# EAGLE design Main Board (EAGLE 5.11)
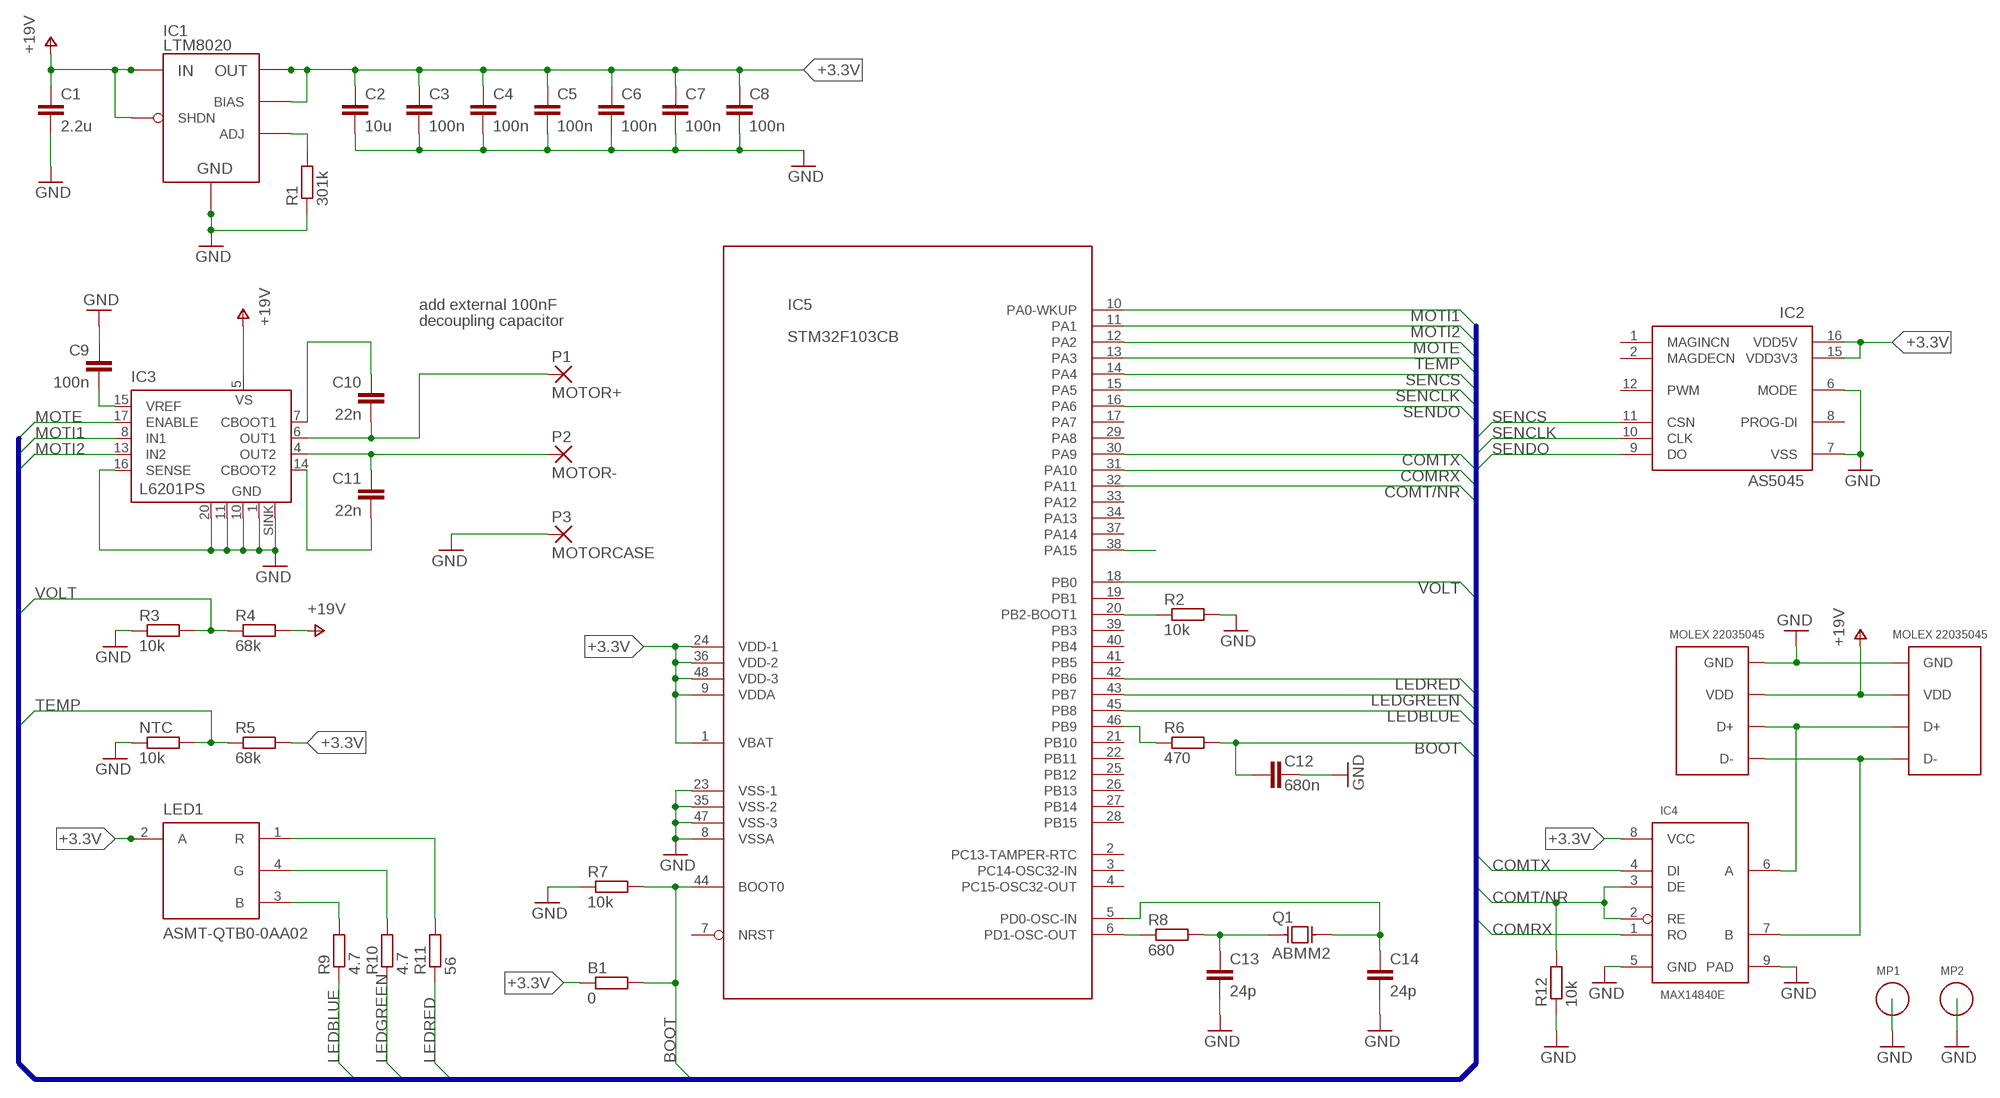
[diagram p0: schematic, sheet 1]

## Parts
B1  0  R-EU_R0603  [R0603]
C1  2.2u  C-EUC1206  [C1206]
C2  10u  C-EUC1206  [C1206]
C3  100n  C-EUC0402  [C0402]
C4  100n  C-EUC0402  [C0402]
C5  100n  C-EUC0402  [C0402]
C6  100n  C-EUC0402  [C0402]
C7  100n  C-EUC0402  [C0402]
C8  100n  C-EUC0402  [C0402]
C9  100n  C-EUC0402  [C0402]
C10  22n  C-EUC0402  [C0402]
C11  22n  C-EUC0402  [C0402]
C12  680n  C-EUC0603  [C0603]
C13  24p  C-EUC0402  [C0402]
C14  24p  C-EUC0402  [C0402]
IC1  LTM8020  [LGA21]
IC2  AS5045  [SSOP16]
IC3  L6201PS  [POWERSO20]
IC4  MAX14840E  [TDFN8]
IC5  STM32F103CB  [LQFP48]
LED1  ASMT-QTB0-0AA02  [PLCC4]
MP1  MOUNTINGPAD-64  [PAD-2X3-ROUND]
MP2  MOUNTINGPAD-64  [PAD-2X3-ROUND]
NTC  10k  R-EU_R0603  [R0603]
P1  MOTOR+  PAD-2X3  [PAD-2X3]
P2  MOTOR-  PAD-2X3  [PAD-2X3]
P3  MOTORCASE  PAD-2X3  [PAD-2X3]
Q1  ABMM2  [CRYSTAL-6X3.6]
R1  301k  R-EU_R0603  [R0603]
R2  10k  R-EU_R0402  [R0402]
R3  10k  R-EU_R0402  [R0402]
R4  68k  R-EU_R0402  [R0402]
R5  68k  R-EU_R0402  [R0402]
R6  470  R-EU_R0402  [R0402]
R7  10k  R-EU_R0402  [R0402]
R8  680  R-EU_R0402  [R0402]
R9  4.7  R-EU_R0402  [R0402]
R10  4.7  R-EU_R0402  [R0402]
R11  56  R-EU_R0402  [R0402]
R12  10k  R-EU_R0402  [R0402]
U1  MOLEX22035045  [MOLEX22035045]
U2  MOLEX22035045  [MOLEX22035045]

## Nets
+3.3V [lowpower]: B1.1 C2.1 C3.1 C4.1 C5.1 C6.1 C7.1 C8.1 IC1.A4(OUT) IC1.A5(OUT) IC1.B4(OUT) IC1.B5(OUT) IC1.C3(BIAS) IC1.C4(OUT) IC1.C5(OUT) IC2.15(VDD3V3) IC2.16(VDD5V) IC4.8(VCC) IC5.1(VBAT) IC5.9(VDDA) IC5.24(VDD-1) IC5.36(VDD-2) IC5.48(VDD-3) LED1.2(A) LED1.SINK1(A) LED1.SINK2(A) R5.2
BOOT: B1.2 C12.2 IC5.44(BOOT0) R6.2 R7.2
COMRX: IC4.1(RO) IC5.31(PA10)
COMT/NR: IC4.2(RE) IC4.3(DE) IC5.32(PA11) R12.2
COMTX: IC4.4(DI) IC5.30(PA9)
GND [gnd]: C1.2 C2.2 C3.2 C4.2 C5.2 C6.2 C7.2 C8.2 C9.1 C12.1 C13.2 C14.2 IC1.C2(GND) IC1.D1(GND) IC1.D2(GND) IC1.D3(GND) IC1.D4(GND) IC1.D5(GND) IC1.E2(GND) IC1.E3(GND) IC1.E4(GND) IC1.E5(GND) IC2.6(MODE) IC2.7(VSS) IC3.1(GND) IC3.10(GND) IC3.11(GND) IC3.16(SENSE) IC3.20(GND) IC3.SINK IC4.5(GND) IC4.9(PAD) IC5.8(VSSA) IC5.23(VSS-1) IC5.35(VSS-2) IC5.47(VSS-3) MP1.1(MP) MP2.1(MP) NTC.1 P3.1 R1.1 R2.2 R3.1 R7.1 R12.1 U1.GND U2.GND
LEDBLUE: IC5.45(PB8) R9.1
LEDGREEN: IC5.43(PB7) R10.1
LEDRED: IC5.42(PB6) R11.1
MOTE: IC3.17(ENABLE) IC5.12(PA2)
MOTI1: IC3.8(IN1) IC5.10(PA0-WKUP)
MOTI2: IC3.13(IN2) IC5.11(PA1)
N$1: IC5.20(PB2-BOOT1) R2.1
N$2: IC5.46(PB9) R6.1
N$3: LED1.3(B) R9.2
N$4 [lowpower]: IC1.E1(ADJ) R1.2
N$5: LED1.4(G) R10.2
N$6: LED1.1(R) R11.2
N$7: C14.1 IC5.5(PD0-OSC-IN) Q1.3
N$8: C13.1 Q1.1 R8.2
N$9: IC5.6(PD1-OSC-OUT) R8.1
N$10: C9.2 IC3.15(VREF)
N$11: IC5.38(PA15)
N$12 [motor]: C10.2 IC3.6(OUT1) P1.1
N$13: IC4.7(B) U1.D- U2.D-
N$14: IC4.6(A) U1.D+ U2.D+
N$15 [lowpower]: C10.1 IC3.7(CBOOT1)
N$16 [lowpower]: C11.2 IC3.14(CBOOT2)
N$18 [motor]: C11.1 IC3.4(OUT2) P2.1
SENCLK: IC2.10(CLK) IC5.15(PA5)
SENCS: IC2.11(CSN) IC5.14(PA4)
SENDO: IC2.9(DO) IC5.16(PA6)
TEMP: IC5.13(PA3) NTC.2 R5.1
V+ [highpower]: C1.1 IC1.A1(IN) IC1.A2(IN) IC1.C1(SHDN) IC3.5(VS) R4.2 U1.VDD U2.VDD ; supply symbol labelled +19V
VOLT: IC5.18(PB0) R3.2 R4.1
Unconnected: IC2.1(MAGINCN) IC2.2(MAGDECN) IC2.8(PROG-DI) IC2.12(PWM) IC5.2(PC13-TAMPER-RTC) IC5.3(PC14-OSC32-IN) IC5.4(PC15-OSC32-OUT) IC5.7(NRST) IC5.17(PA7) IC5.19(PB1) IC5.21(PB10) IC5.22(PB11) IC5.25(PB12) IC5.26(PB13) IC5.27(PB14) IC5.28(PB15) IC5.29(PA8) IC5.33(PA12) IC5.34(PA13) IC5.37(PA14) IC5.39(PB3) IC5.40(PB4) IC5.41(PB5)

## Buses
COMT/NR,COMTX,COMRX,MOTE,MOTI1,MOTI2,SENCS,SENCLK,SENDO,LEDRED,LEDGREEN,LEDBLUE,BOOT,TEMP,VOLT

## Notes on the sheet
- add external 100nF
- decoupling capacitor
- LEDRED
- LEDGREEN
- LEDBLUE

## Library data of the parts
B1 NTC R1-R12 = rcl:R-EU_: RESISTOR, European symbol
C1-C14 = rcl:C-EU: CAPACITOR, European symbol
IC1 = sim:LTM8020: VOLTAGE REGULATOR LTM8020
IC2 = sim:AS5045: ANGULAR ENCODER AS5045
IC3 = sim:L6201: DMOS FULL BRIDGE DRIVER
IC4 = sim:MAX14840E: TRANSCEIVER MAX14840E
IC5 = sim:STM32F103CB: CONTROLLER STM32F103CB
LED1 = sim:ASMT-QTB0-0AA02: LED RGB ASMT-QTB0-0AA02
MP1 MP2 = sim:MOUNTINGPAD-64: MOUNTING PAD FOR DD-64
P1-P3 = sim:PAD-2X3: SMD PAD 2mm x 3mm
Q1 = sim:ABMM2: CERAMIC CRYSTAL ABMM2
U1 U2 = sim:MOLEX22035045: CONNECTOR MOLEX22035045

## Net classes
0 default: width 0.15 mm, drill 0.3 mm, clearance 0.15 mm
1 motor: width 0.15 mm, drill 0.3 mm, clearance 0.15 mm
2 highpower: width 0.15 mm, drill 0.3 mm, clearance 0.15 mm
3 lowpower: width 0.15 mm, drill 0.3 mm, clearance 0.15 mm
4 gnd: width 0.15 mm, drill 0.3 mm, clearance 0.15 mm

## Board
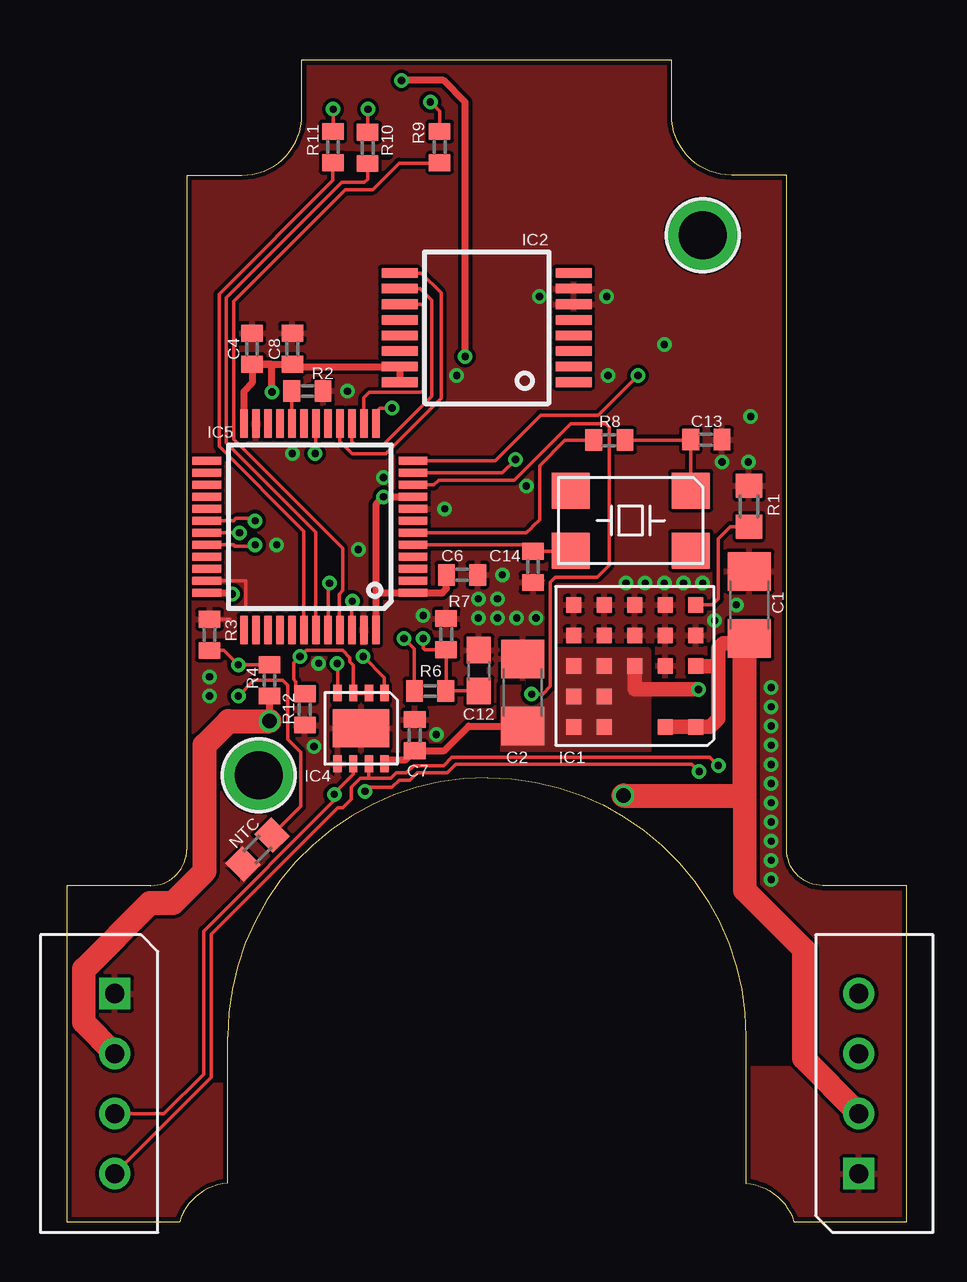
[diagram p1: board, top side]
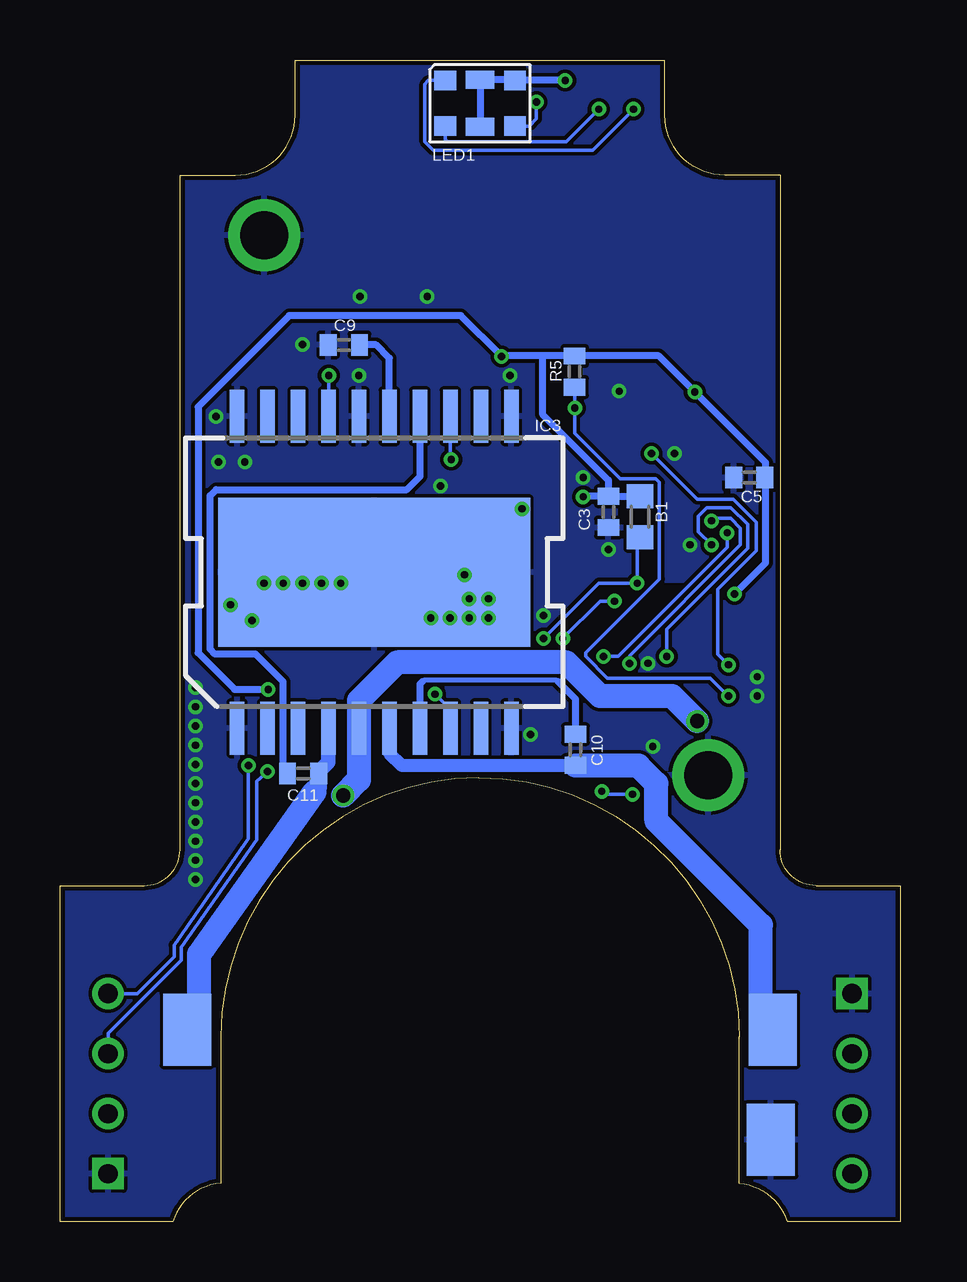
[diagram p2: board, bottom side, seen from below]

Size 35 x 48.4 mm. Coordinates in mm from the lower left corner, seen from the top.
Outline: 0,0 4.7,0 arc-67 6.7,1.6 6.7,7.7 arc-90 17.55,18.5 arc-90 28.3,7.7 28.3,1.6 arc-67 30.3,0 35,0 35,14 31.5,14 arc-90 30,15.5 30,43.6 27.7,43.6 arc-90 25.2,46.1 25.2,48.4 9.8,48.4 9.8,46.1 arc-90 7.3,43.6 5,43.6 5,15.5 arc-90 3.5,14 0,14 0,0
Copper layers (1*16): Top 0.035mm / dielectric 1.5mm / Bottom 0.035mm
Design rules "default *": minimum track width 0.15mm, minimum drill 0.3mm, track to track 0.15mm, track to pad 0.15mm, pad to pad 0.15mm, via to via 0.15mm, smd to smd 0.15mm, copper to edge 0.2mm, drill to drill 0.15mm, minimum pad ring 10mil, minimum via ring 6mil, stop-mask expansion 4mil, vias tented up to drill 0mil, thermal gap 0.15mm
tKeepout: area 10,41.3 to 14,42.8; area 10,35 to 14,36.5; area 21,41.3 to 25,42.8; area 21,35 to 25,36.5; area 14.8,29.9 to 16.3,33.4; area 18.7,29.9 to 20.2,33.4; area 20.2,43.4 to 21.7,46.4; area 13.3,43.4 to 14.8,46.4; area 5,18.1 to 6.3,19.1; area 27.8,21.8 to 30,23.3; area 5,21.8 to 7.2,23.3; area 27.8,36.8 to 30,38.3; 1 more areas
bKeepout: area 14,33.9 to 21,40.9; area 16.5,40.9 to 18.5,44.7; area 29,18.5 to 30,20; area 5,18.5 to 6,20; area 29,34 to 30,35.5; area 5,34 to 6,35.5
tRestrict: area 13.1,44.4 to 13.4,44.5; area 11.6,44.4 to 12,44.5; area 6.2,6 to 6.5,6.2; area 28.4,6.7 to 30.1,6.8; area 16.9,22.8 to 17.4,23.1; area 14.9,21.6 to 15.4,21.8; area 13.7,29.6 to 13.8,29.9; area 6.5,24.1 to 7.1,24.1; area 7.8,33.9 to 8,34.1; area 10.1,34.4 to 10.2,34.8
bRestrict: area 9,26.6 to 9.9,26.6; area 6.1,31.5 to 6.5,31.5; area 6.3,30.8 to 6.5,31.2; area 11.6,29.4 to 11.8,29.8; area 13.2,35.2 to 13.4,35.6; area 24.2,21.7 to 24.6,21.8; area 23.1,21.7 to 23.5,21.8

### Footprints (pad centres in the part's own frame; a part is rotated, then mirrored left to right if it is on the bottom)
R0603 = smd 1 x 1.1: 1 -0.85,0; 2 0.85,0
C1206 = smd 1.6 x 1.8: 1 -1.4,0; 2 1.4,0
C0402 = smd 0.7 x 0.9: 1 -0.65,0; 2 0.65,0
C0603 = smd 1.1 x 1: 1 -0.85,0; 2 0.85,0
LGA21 = smd 0.635 x 0.635: A1 2.54,-2.54; A2 1.27,-2.54; A4 -1.27,-2.54; A5 -2.54,-2.54; B4 -1.27,-1.27; B5 -2.54,-1.27; C1 2.54,0; C2 1.27,0; C3 0,0; C4 -1.27,0; C5 -2.54,0; D1 2.54,1.27; D2 1.27,1.27; D3 0,1.27; D4 -1.27,1.27; D5 -2.54,1.27; E1 2.54,2.54; E2 1.27,2.54; E3 0,2.54; E4 -1.27,2.54; E5 -2.54,2.54
SSOP16 = smd 1.5 x 0.4: 1 3.625,-2.275; 2 3.625,-1.625; 3 3.625,-0.975; 4 3.625,-0.325; 5 3.625,0.325; 6 3.625,0.975; 7 3.625,1.625; 8 3.625,2.275; 9 -3.625,2.275; 10 -3.625,1.625; 11 -3.625,0.975; 12 -3.625,0.325; 13 -3.625,-0.325; 14 -3.625,-0.975; 15 -3.625,-1.625; 16 -3.625,-2.275
POWERSO20 = smd 0.6 x 2.2: 1 -5.715,-6.5; 2 -4.445,-6.5; 3 -3.175,-6.5; 4 -1.905,-6.5; 5 -0.635,-6.5; 6 0.635,-6.5; 7 1.905,-6.5; 8 3.175,-6.5; 9 4.445,-6.5; 10 5.715,-6.5; 11 5.715,6.5; 12 4.445,6.5; 13 3.175,6.5; 14 1.905,6.5; 15 0.635,6.5; 16 -0.635,6.5; 17 -1.905,6.5; 18 -3.175,6.5; 19 -4.445,6.5; 20 -5.715,6.5 | smd 13 x 6.2: SINK 0,0
TDFN8 = smd 0.35 x 0.7: 1 -0.975,-1.475; 2 -0.325,-1.475; 3 0.325,-1.475; 4 0.975,-1.475; 5 0.975,1.475; 6 0.325,1.475; 7 -0.325,1.475; 8 -0.975,1.475 | smd 2.35 x 1.58: 9 0,0
LQFP48 = smd 1.2 x 0.32: 1 -4.3,2.75; 2 -4.3,2.25; 3 -4.3,1.75; 4 -4.3,1.25; 5 -4.3,0.75; 6 -4.3,0.25; 7 -4.3,-0.25; 8 -4.3,-0.75; 9 -4.3,-1.25; 10 -4.3,-1.75; 11 -4.3,-2.25; 12 -4.3,-2.75; 25 4.3,-2.75; 26 4.3,-2.25; 27 4.3,-1.75; 28 4.3,-1.25; 29 4.3,-0.75; 30 4.3,-0.25; 31 4.3,0.25; 32 4.3,0.75; 33 4.3,1.25; 34 4.3,1.75; 35 4.3,2.25; 36 4.3,2.75 | smd 0.32 x 1.2: 13 -2.75,-4.3; 14 -2.25,-4.3; 15 -1.75,-4.3; 16 -1.25,-4.3; 17 -0.75,-4.3; 18 -0.25,-4.3; 19 0.25,-4.3; 20 0.75,-4.3; 21 1.25,-4.3; 22 1.75,-4.3; 23 2.25,-4.3; 24 2.75,-4.3; 37 2.75,4.3; 38 2.25,4.3; 39 1.75,4.3; 40 1.25,4.3; 41 0.75,4.3; 42 0.25,4.3; 43 -0.25,4.3; 44 -0.75,4.3; 45 -1.25,4.3; 46 -1.75,4.3; 47 -2.25,4.3; 48 -2.75,4.3
PLCC4 = smd 0.8 x 0.9: 1 -0.95,-1.45; 2 -0.95,1.45; 3 0.95,1.45; 4 0.95,-1.45 | smd 0.75 x 1.2: SINK1 -0.975,0; SINK2 0.975,0
PAD-2X3-ROUND = drill 2 pad 3 round: 1 0,0
PAD-2X3 = smd 3 x 2: 1 0,0
CRYSTAL-6X3.6 = smd 1.6 x 1.5: 1 -2.5,-1.25; 2 2.5,-1.25; 3 2.5,1.25; 4 -2.5,1.25
R0402 = smd 0.7 x 0.9: 1 -0.65,0; 2 0.65,0
MOLEX22035045 = drill 0.8 round: D+ 7.45,3.1; D- 9.95,3.1; VDD 4.95,3.1 | drill 0.8 square: GND 2.45,3.1

### Placement (x,y rotation side)
B1  10.84,29.36 270 bottom
C1  28.44,25.69 90 top
C2  19,22.04 90 top
C3  12.15,29.57 270 bottom
C4  7.72,36.37 90 top
C5  6.28,31 180 bottom
C6  16.47,26.95 0 top
C7  14.5,20.27 90 top
C8  9.4,36.37 90 top
C9  23.17,36.53 0 bottom
C10  13.52,19.66 270 bottom
C11  24.87,18.67 180 bottom
C12  17.17,22.96 270 top
C13  26.65,32.58 0 top
C14  19.43,27.28 270 top
IC1  23.67,23.15 0 top
IC2  17.5,37.25 0 top
IC3  21.91,27.05 0 bottom
IC4  12.26,20.55 180 top
IC5  10.13,28.95 180 top
LED1  17.5,46.6 270 bottom
MP1  8,18.6 0 top
MP2  26.5,41.1 0 top
NTC  7.95,15.5 45 top
P1  5.3,8 90 bottom
P2  29.7,8 90 bottom
P3  5.38,3.4 90 bottom
Q1  23.5,29.21 180 top
R1  28.43,29.8 270 top
R2  10.03,34.61 0 top
R3  5.95,24.45 270 top
R4  8.45,22.55 270 top
R5  13.56,35.42 90 bottom
R6  15.14,22.11 0 top
R7  15.81,24.48 270 top
R8  22.61,32.56 0 top
R9  15.54,44.77 90 top
R10  12.54,44.74 90 top
R11  11.09,44.77 90 top
R12  9.92,21.34 90 top
U1  36.1,-0.45 90 top
U2  -1.1,11.95 270 top

### Tracks (layer width: path | path; a pad name or v marks a point on that pad's centre or on a via)
+3.3V  (via drill 0.3)
  Top 0.3: IC1.B5 21.31,21.9 | IC5.24 7.38,34.58 7.72,34.95 C4.1 | C4.1 C8.1 9.49,35.62 IC2.15 IC2.16 | v8.55,34.57 8.55,35.72 C4.1 | IC5.9 | IC5.1 | IC5.36 6.65,26.2 v6.9,26.15 | IC5.9 | 12.88,26.15 IC5.48 | 12.88,26.15 12.88,29.88 v13.2,30.2 IC5.9 | IC5.1 12.93,26.2 12.88,26.15 | IC5.1 15.65,26.2 15.82,26.37 C6.1 | v13.95,47.55 15.7,47.55 16.6,46.65 v16.6,36.05 | IC4.8 13.24,19.25 14.13,19.25 C7.1 15.72,19.62 16.75,20.65 C2.1
  Top 0.6: v26.32,22.18 23.67,22.18 IC1.C3
  Bottom 0.3: LED1.SINK1 LED1.SINK2 | LED1.SINK1 17.48,47.55 | LED1.SINK1 16.07,47.58 LED1.2 v13.95,47.55 | 5.6,31.03 5.6,31.62 v8.55,34.57 10.05,36.07 R5.2 14.9,36.07 | 5.6,31.03 C5.1 | C3.1 12.15,30.9 14.9,33.65 14.9,36.07 | C3.1 13.18,30.22 v13.2,30.2 | 14.9,36.07 16.6,36.07 v16.6,36.05 18.3,37.75 25.45,37.75 29.25,33.95 29.25,23.7 27.73,22.18 v26.32,22.18 | 5.6,31.03 5.6,27.45 v6.9,26.15 | C3.1 B1.1
  pour Top (isolate 0.15, no thermals): 24.2,19.55 18.2,19.55 18.2,22.25 20.5,22.25 20.5,23.8 24.2,23.8
BOOT  (via drill 0.3)
  Top 0.15: IC5.44 10.9,24.67 10.9,26.6 v10.95,26.6 | v14.85,24.3 14.85,23.9 14.93,23.82 R7.2 15.81,22.13 R6.2 C12.2
  Bottom 0.15: v14.85,24.3 12.55,26.6 v10.95,26.6 10.95,28.52 B1.2
COMRX  (via drill 0.3)
  Top 0.15: IC4.1 13.24,22.66 v12.35,23.55 | IC5.31 v7.2,28.7
  Bottom 0.15: v12.35,23.55 11.75,23.55 7.2,28.1 v7.2,28.7
COMT/NR  (via drill 0.3)
  Top 0.15: IC4.3 IC4.2 | IC4.3 11.95,22.04 | R12.2 9.55,22.31 9.55,22.5 9.45,22.6 9.45,23.28 v9.72,23.55 9.97,23.8 11.5,23.8 11.8,23.5 11.8,23.32 11.94,23.19 IC4.3 | IC5.32 6.95,28.2 7,28.15 7.8,28.15 v7.85,28.2 | IC4.3 11.85,22.02
  Bottom 0.15: v7.85,28.2 8.4,28.75 8.4,29.4 8.05,29.75 7.05,29.75 6.35,29.05 6.35,28.05 9.72,24.68 v9.72,23.55
COMTX  (via drill 0.3)
  Top 0.15: IC4.4 11.3,22.04 11.3,23.22 v11.27,23.25 | v7.85,29.2 7.75,29.3 7.05,29.3 6.95,29.2 IC5.30
  Bottom 0.15: v11.27,23.25 11.27,23.58 6.65,28.2 6.65,28.9 7.05,29.3 7.75,29.3 v7.85,29.2
GND  (via drill 0.3)
  Top 0.15: R3.1 6.8,25.1 | IC5.35 7.45,26.7 7.45,25.65
  other vias: 5.95,21.9 27.3,31.65 11.7,34.6 10.5,23.26 26.5,26.6 15.4,20.3 8.75,28.2 9.4,32 15.75,29.7 19.15,30.65 13.2,31 12.15,28 19.7,38.55 24.9,36.55 28.4,31.65 28.5,33.55 22.55,35.25 14.85,25.25 10.3,19.8 18.15,26.95 17.15,25.15 17.15,25.95 17.95,25.15 18.75,25.15 17.95,25.95 19.55,25.15 25.7,26.6 24.9,26.6 24.1,26.6 23.3,26.6 27.9,25.7 27,25.05 29.35,14.25 29.35,15.05 29.35,15.85 29.35,16.65 29.35,17.45 29.35,18.25 29.35,19.05 29.35,19.85 29.35,20.65 29.35,21.45 29.35,22.25 5.95,22.7 22.5,38.55 16.25,35.25
  pour Top (isolate 0.15, rank 2): 0,0 35,0 35,1.8 35,48.4 10.6,48.4 0,48.4
  pour Bottom (rank 2): 0,0 35,0 35,12.4 35,48.4 11.1,48.4 0,48.4
LEDBLUE
  Top 0.15: IC5.45 11.35,24.65 11.35,26.15 11.5,26.3 11.5,28.05 6.95,32.6 6.95,38.35 11.6,43 12.75,43 13.85,44.1 15.52,44.1 R9.1
LEDGREEN
  Top 0.15: R10.1 12.54,43.44 12.4,43.3 11.45,43.3 6.65,38.5 6.65,32.45 10.38,28.72 IC5.43
LEDRED
  Top 0.15: IC5.42 9.88,28.77 6.35,32.3 6.35,38.65 11.09,43.39 R11.1
MOTE  (via drill 0.3)
  Top 0.15: IC5.12 17.85,31.7 19.75,33.6 22.15,33.6 v23.8,35.25
  Bottom 0.15: v23.8,35.25 23.8,33.57 IC3.17
MOTI1  (via drill 0.3)
  Top 0.15: v19.38,21.98 19.82,21.98 20.15,22.3 20.15,26.65 20.35,26.85 22.1,26.85 22.6,27.35 22.6,33.1 22.45,33.25 21,33.25 18.65,30.9 15.5,30.9 15.3,30.7 IC5.10
  Bottom 0.15: IC3.8 18.73,21.36 v19.38,21.98
MOTI2  (via drill 0.3)
  Top 0.15: IC5.11 18.15,31.2 v18.7,31.75
  Bottom 0.15: v18.7,31.75 18.73,31.78 IC3.13
N$1
  Top 0.15: IC5.20 R2.1
N$2  (via drill 0.3)
  Top 0.15: IC5.46 11.88,25.78 v11.9,25.85 | v14.05,24.3 14.49,23.86 R6.1
  Bottom 0.15: v11.9,25.85 12.5,25.85 v14.05,24.3
N$3  (via drill 0.3)
  Top 0.15: R9.2 15.54,46.26 v15.15,46.65
  Bottom 0.15: v15.15,46.65 15.15,45.95 15.45,45.65 LED1.3
N$4
  Top 0.15: R1.2 27.65,28.95 27.15,28.45 27.15,25.95 26.9,25.7 IC1.E1
N$5  (via drill 0.3)
  Top 0.15: v12.55,46.35 R10.2
  Bottom 0.15: v12.55,46.35 13.9,45 18.85,45 18.95,45.1 LED1.4
N$6  (via drill 0.3)
  Top 0.15: v11.1,46.35 R11.2
  Bottom 0.15: LED1.1 19.65,47.55 19.8,47.4 19.8,45 19.45,44.65 12.8,44.65 v11.1,46.35
N$7
  Top 0.15: IC5.5 19.21,28.2 C14.1 21.38,27.93 21.5,28.05 21.09,28.05 Q1.3
N$8
  Top 0.15: R8.2 25.98,32.56 C13.1 Q1.1
N$9
  Top 0.15: R8.1 20.75,32.55 19.7,31.5 19.7,29.25 19.43,28.98 19.35,28.9 19.15,28.7 IC5.6
N$10
  Bottom 0.3: 21.37,33.66 IC3.15 21.27,35.97 21.83,36.53 C9.2
N$12
  Bottom 0.55: C10.2 20.75,19 21.27,19.52 IC3.6
  Bottom 0.6: C10.2
  Bottom 1: P1.1 5.7,8 | P1.1 5.75,8 | P1.1 5.3,8.55 5.8,9.05 5.8,12.35 10.15,16.7 10.15,18.25 10.9,19 C10.2
N$13  (via drill 0.3)
  Top 0.15: U2.D- 6.03,6.03 6.03,11.97 11.3,17.25 11.5,17.25 11.85,17.6 11.85,18.1 12.22,18.48 12.59,18.48 | v27.15,19 26.8,19.35 16.05,19.35 15.7,19 14.45,19 14.15,18.7 13.72,18.7 13.5,18.48 12.59,18.48 | 12.59,18.48 IC4.7
  Bottom 0.15: U1.D- 31.78,9.5 30.25,11.03 30.25,11.52 27.15,15.95 v27.15,19
N$14  (via drill 0.3)
  Top 0.15: U2.D+ 4.05,4.5 5.7,6.15 5.7,12.1 11.15,17.55 v11.15,17.8 11.15,17.85 11.94,18.64 IC4.6 | v26.35,18.75 26.05,19.05 16.2,19.05 15.85,18.7 14.6,18.7 14.3,18.4 13.85,18.4 13.55,18.1 12.6,18.1 v12.43,17.93
  Bottom 0.15: v26.35,18.75 26.8,18.35 26.8,15.91 29.94,11.43 29.94,10.9 33,7.84 U1.D+ | v11.15,17.8 12.3,17.8 v12.43,17.93
N$15
  Bottom 0.2: 19.9,22.5 19.85,22.55 14.3,22.55 14.1,22.35
  Bottom 0.3: IC3.7 20,22.4 19.9,22.5 | 14.25,22.5 14.1,22.35 13.52,21.77 C10.1
N$16
  Bottom 0.3: IC3.14 20,31.05 20.55,30.5 28.5,30.5 28.75,30.25 28.75,23.85 28.55,23.65 26.85,23.65 25.7,22.5 25.7,18.85 C11.2
N$18
  Bottom 0.55: C11.1 24.23,18.72
  Bottom 0.6: P2.1 29.1,8.6 | IC3.4 23.81,19.14 24.23,18.72
  Bottom 0.7: 24.4,17.9 24.22,18.08 C11.1
  Bottom 1: 24.4,17.9 29.2,11.15 29.2,8 P2.1
SENCLK
  Top 0.15: IC2.10 14.72,38.88 15.2,38.4 15.2,34.4 13.2,32.4 12,32.4 11.88,32.52 IC5.15
SENCS
  Top 0.15: IC2.11 14.78,38.23 14.85,38.15 14.85,34.65 14.75,34.55 12.6,34.55 12.38,34.33 IC5.14
SENDO
  Top 0.15: IC5.16 11.38,32.52 11.9,32 13.3,32 15.6,34.3 15.6,38.7 14.78,39.52 IC2.9
TEMP  (via drill 0.3)
  Top 0.15: NTC.2 9.75,17.3 9.75,19.55 9.2,20.1 9.2,22.35 9,22.55 7.8,22.55 v7.15,21.9 | IC5.13 12.88,33.73 13.05,33.9 v13.55,33.9
  Bottom 0.15: R5.1 v13.55,33.9 13.55,32.85 11.65,30.95 10.18,30.95 10.03,30.8 10.03,26.77 13.1,23.7 13.1,23.55 12.2,22.65 7.9,22.65 v7.15,21.9
V+  (via drill 0.6)
  Top 0.3: v8.45,20.85 R4.2
  Top 0.6: IC1.A2 IC1.A1 26.81,20.61 27.15,20.95 27.15,23.15 | 28.25,24.1 27.35,24.1 27.15,23.9 27.15,23.15 | IC1.C1 27.15,23.15
  Top 0.98: 0.72,10.52 0.7,10.5 0.7,8.3 U2.VDD | 28.25,17.75 28.25,13.8 30.7,11.35 30.7,6.8 U1.VDD
  Top 1: 0.72,10.52 3.48,13.28 4.43,13.28 5.75,14.6 5.75,19.85 6.75,20.85 v8.45,20.85 | C1.1 arc90 28.25,24.1 28.25,17.75 v23.2,17.75
  Bottom 1: v23.2,17.75 22.54,18.41 IC3.5 22.54,21.71 20.95,23.3 13.9,23.3 12.5,21.9 9.5,21.9 v8.45,20.85
VOLT  (via drill 0.3)
  Top 0.15: R4.1 v7.15,23.2 6.55,23.8 R3.2 | IC5.18 10.38,32.03 v10.35,32
  Bottom 0.15: v10.35,32 8.45,30.1 6.95,30.1 6,29.15 6,27.95 7.6,26.35 7.6,23.65 v7.15,23.2